# Altium project HT_L293D_Driver.PrjPcb
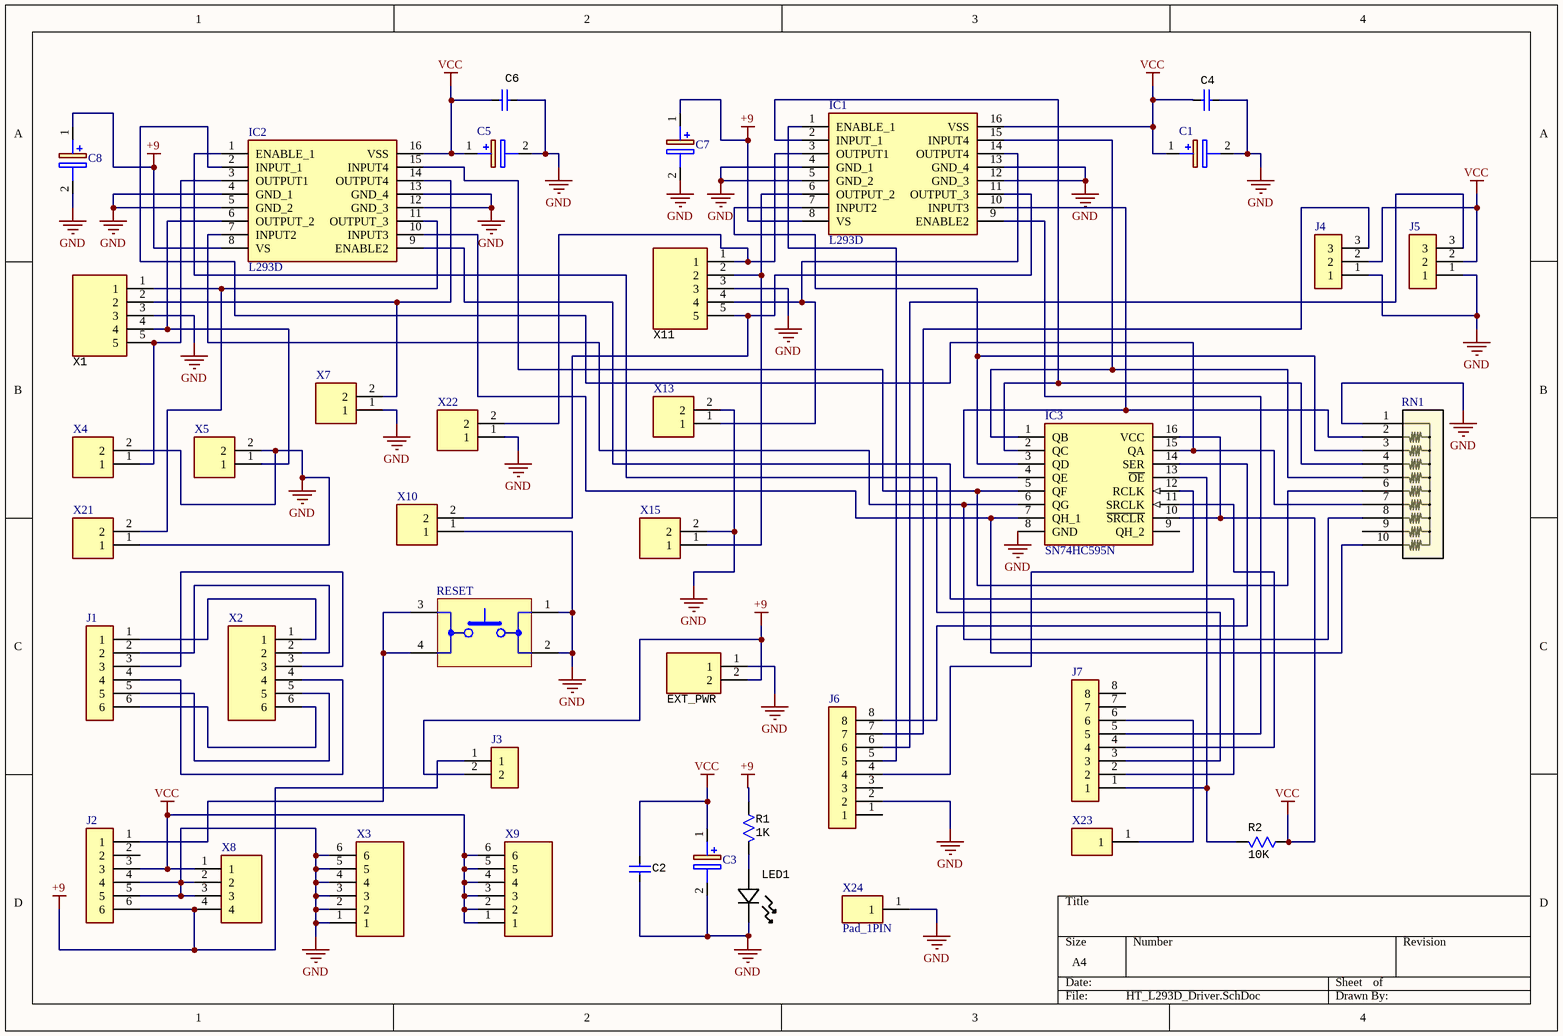
[diagram p0: HT_L293D_Driver.SchDoc]
1 sheet, 40 parts. Net scope: global (net labels, ports and power ports of the same name join across sheets).
Board file: HT_L293D_Driver.PcbDoc

## Sheet HT_L293D_Driver.SchDoc
size A4

### Parts
C1  Aluminum_Electrolytic_Capacitor  [Aluminum_Electrolytic_Capacitor]  (value not drawn)
C2  (no value)  [CERAMIC_CAPACITOR_0.1uF]
C3  Aluminum_Electrolytic_Capacitor  [Aluminum_Electrolytic_Capacitor]  (value not drawn)
C4  (no value)  [CERAMIC_CAPACITOR_0.1uF]
C5  Aluminum_Electrolytic_Capacitor  [Aluminum_Electrolytic_Capacitor]  (value not drawn)
C6  (no value)  [CERAMIC_CAPACITOR_0.1uF]
C7  Aluminum_Electrolytic_Capacitor  [Aluminum_Electrolytic_Capacitor]  (value not drawn)
C8  Aluminum_Electrolytic_Capacitor  [Aluminum_Electrolytic_Capacitor]  (value not drawn)
EXT_PWR  (no value)  [Terminal_Block_2PIN]
IC1  L293D  [L293D_WITH_DIP16]
IC2  L293D  [L293D_WITH_DIP16]
IC3  SN74HC595N  [L293D_WITH_DIP16]
J1  Headers_6PIN  [HEADERS_6PIN]  (value not drawn)
J2  Headers_6PIN  [HEADERS_6PIN]  (value not drawn)
J3  Headers_2PIN  [HEADERS_2PIN]  (value not drawn)
J4  Headers_3PIN  [HEADERS_3PIN]  (value not drawn)
J5  Headers_3PIN  [HEADERS_3PIN]  (value not drawn)
J6  Headers_8PIN  [HEADERS_8PIN]  (value not drawn)
J7  Headers_8PIN  [HEADERS_8PIN]  (value not drawn)
LED1  (no value)  [Green_LED_3mm]
R1  value 1K  [RESISTOR_TH_1K]
R2  value 10K  [RESISTOR_TH_10K]
RESET  1825910-6  [1825910-6]  (value not drawn)
RN1  Resistor_Network_10K  [RESISTOR_NETWORK_10K]  (value not drawn)
X1  (no value)  [TERMINAL_BLOCK_5PIN]
X2  Pad_6PIN  [PAD_6PIN]  (value not drawn)
X3  Pad_6PIN  [PAD_6PIN]  (value not drawn)
X4  Pad_2PIN  [PAD_2PIN]  (value not drawn)
X5  Pad_2PIN  [PAD_2PIN]  (value not drawn)
X7  Pad_2PIN  [PAD_2PIN]  (value not drawn)
X8  Pad_4PIN  [PAD_4PIN]  (value not drawn)
X9  Pad_6PIN  [PAD_6PIN]  (value not drawn)
X10  Pad_2PIN  [PAD_2PIN]  (value not drawn)
X11  (no value)  [TERMINAL_BLOCK_5PIN]
X13  Pad_2PIN  [PAD_2PIN]  (value not drawn)
X15  Pad_2PIN  [PAD_2PIN]  (value not drawn)
X21  Pad_2PIN  [PAD_2PIN]  (value not drawn)
X22  Pad_2PIN  [PAD_2PIN]  (value not drawn)
X23  Pad_1PIN  [PAD_1PIN]  (value not drawn)
X24  Pad_1PIN  [PAD_1PIN]

### Nets
+9: C7.1(+) C8.1(+) EXT_PWR.2 IC1.8(VS) IC2.8(VS) J2.6 J3.1 J3.2 R1.1 X8.4
GND: C1.2(-) C2.2 C3.2(-) C4.2 C5.2(-) C6.2 C7.2(-) C8.2(-) EXT_PWR.1 IC1.4(GND_1) IC1.5(GND_2) IC1.12(GND_3) IC1.13(GND_4) IC2.4(GND_1) IC2.5(GND_2) IC2.12(GND_3) IC2.13(GND_4) IC3.8(GND) J2.4 J2.5 J4.1 J5.1 J6.2 LED1.1 RESET.1 RESET.2 RN1.1 X1.3 X3.1 X3.2 X3.3 X3.4 X3.5 X3.6 X4.2 X5.2 X7.1 X8.2 X8.3 X10.1 X11.3 X13.2 X15.2 X21.1 X22.1 X24.1
VCC: C1.1(+) C2.1 C3.1(+) C4.1 C5.1(+) C6.1 IC1.16(VSS) IC2.16(VSS) IC3.10(~{SRCLR}) IC3.16(VCC) J2.3 J4.2 J5.2 R2.1 X8.1 X9.1 X9.2 X9.3 X9.4 X9.5 X9.6
NetIC1_1: IC1.1(ENABLE_1) J6.5
NetIC1_2: IC1.2(INPUT_1) IC3.2(QC) RN1.4
NetIC1_3: IC1.3(OUTPUT1) X11.1 X22.2
NetIC1_6: IC1.6(OUTPUT_2) X11.2 X15.1
NetIC1_7: IC1.7(INPUT2) IC3.3(QD) RN1.3
NetIC1_9: IC1.9(ENABLE2) J7.5
NetIC1_10: IC1.10(INPUT3) IC3.4(QE) RN1.2
NetIC1_11: IC1.11(OUTPUT_3) X10.2 X11.5
NetIC1_14: IC1.14(OUTPUT4) X11.4 X13.1
NetIC1_15: IC1.15(INPUT4) IC3.1(QB) RN1.5
NetIC2_1: IC2.1(ENABLE_1) J7.3
NetIC2_2: IC2.2(INPUT_1) IC3.15(QA) RN1.7
NetIC2_3: IC2.3(OUTPUT1) X1.5 X4.1
NetIC2_6: IC2.6(OUTPUT_2) X1.4 X5.1
NetIC2_7: IC2.7(INPUT2) IC3.6(QG) RN1.8
NetIC2_9: IC2.9(ENABLE2) J7.2
NetIC2_10: IC2.10(INPUT3) IC3.7(QH_1) RN1.10
NetIC2_11: IC2.11(OUTPUT_3) X1.1 X21.2
NetIC2_14: IC2.14(OUTPUT4) X1.2 X7.2
NetIC2_15: IC2.15(INPUT4) IC3.5(QF) RN1.6
NetIC3_11: IC3.11(SRCLK) J7.4
NetIC3_12: IC3.12(RCLK) J6.4
NetIC3_13: IC3.13(~{OE}) J7.1 R2.2
NetIC3_14: IC3.14(SER) J6.8
NetJ1_1: J1.1 X2.1
NetJ1_2: J1.2 X2.2
NetJ1_3: J1.3 X2.3
NetJ1_4: J1.4 X2.4
NetJ1_5: J1.5 X2.5
NetJ1_6: J1.6 X2.6
NetJ2_1: J2.1 RESET.3(MECH1) RESET.4(MECH2)
NetJ4_3: J4.3 J6.7
NetJ5_3: J5.3 J6.6
NetJ7_6: J7.6 X23.1
NetLED1_2: LED1.2 R1.2

Not connected (* = marked no-connect by the designer): IC3 9(QH_2); J2 2; J6 1 3; J7 7 8; RN1 9

### Library data of the parts
C1 = Aluminum_Electrolytic_Capacitor: Capacitor Polarised; Manufacturer_Name: United Chemi-Con; Manufacturer_Part_Number: EKY-350ETC221MH15D; Voltage: 100uF; Value: 16VDC; Datasheet Link: http://www.mouser.com/datasheet/2/420/United-Chemi-Con-1109128.pdf; Height: 21.5mm; Mouser Part Number: N/A; Mouser Price/Stock: https://www.mouser.com/Search/Refine.aspx?Keyword=N%2FA
C2 = Ceramic_Capacitor: Manufacturer: Epcos; PartNumber: B32774D4106K000; ValueManufacturerPartNumber: Film capacitor, 10μF, 450VDC, ±10%, 10.9mOhm, 31.5x15 mm, -40...+105°C; TypeCapacitor: Film capacitor; Tolerance: ±10%; Impedance: 10.9mOhm; Voltage: 450VDC; Value: 10μF; Package: 31.5x15 mm; HelpURL: https://www.digikey.com/products/en/capacitors/film-capacitors/62?k=&pkeyword=&sv=0&pv2097=1958&sf=0&FV=fffc01ef%2C1f140000%2Cffe0003e%2Cffec6366&quantity=1&ColumnSort=1000011&page=1&stock=1&pageSize=25; Temperature: -40...+105°C
C3 = Aluminum_Electrolytic_Capacitor: Capacitor Polarised; Manufacturer_Name: United Chemi-Con; Manufacturer_Part_Number: EKY-350ETC221MH15D; Value: 100uF; Voltage: 16VDC; Datasheet Link: http://www.mouser.com/datasheet/2/420/United-Chemi-Con-1109128.pdf; Height: 21.5mm; Mouser Part Number: N/A; Mouser Price/Stock: https://www.mouser.com/Search/Refine.aspx?Keyword=N%2FA
C4 = Ceramic_Capacitor: Capacitor Non Polarised; Manufacturer: Epcos; PartNumber: B32774D4106K000; ValueManufacturerPartNumber: Film capacitor, 0.1μF, 450VDC, ±10%, 10.9mOhm, 31.5x15 mm, -40...+105°C; TypeCapacitor: Film capacitor; Tolerance: ±10%; Impedance: 10.9mOhm; Voltage: 450VDC; Value: 0.1μF; Package: 31.5x15 mm; HelpURL: https://www.digikey.com/products/en/capacitors/film-capacitors/62?k=&pkeyword=&sv=0&pv2097=1958&sf=0&FV=fffc01ef%2C1f140000%2Cffe0003e%2Cffec6366&quantity=1&ColumnSort=1000011&page=1&stock=1&pageSize=25; Temperature: -40...+105°C
C5 C7 C8 = Aluminum_Electrolytic_Capacitor: Capacitor Polarised; Manufacturer_Name: United Chemi-Con; Manufacturer_Part_Number: EKY-350ETC221MH15D; Voltage: 16VDC; Value: 100uF; Datasheet Link: http://www.mouser.com/datasheet/2/420/United-Chemi-Con-1109128.pdf; Height: 21.5mm; Mouser Part Number: N/A; Mouser Price/Stock: https://www.mouser.com/Search/Refine.aspx?Keyword=N%2FA
C6 = Ceramic_Capacitor: Manufacturer: Epcos; PartNumber: B32774D4106K000; ValueManufacturerPartNumber: Film capacitor, 0.1μF, 450VDC, ±10%, 10.9mOhm, 31.5x15 mm, -40...+105°C; TypeCapacitor: Film capacitor; Tolerance: ±10%; Impedance: 10.9mOhm; Voltage: 450VDC; Value: 0.1μF; Package: 31.5x15 mm; HelpURL: https://www.digikey.com/products/en/capacitors/film-capacitors/62?k=&pkeyword=&sv=0&pv2097=1958&sf=0&FV=fffc01ef%2C1f140000%2Cffe0003e%2Cffec6366&quantity=1&ColumnSort=1000011&page=1&stock=1&pageSize=25; Temperature: -40...+105°C
EXT_PWR = Terminal_Block_2PIN: Manufacturer: Degson; ValueManufacturerPartNumber: Terminal connector, 2pin, 3.5mm, 300VAC, 10A; PartNumber: DG350-3.5-02P-14; TypeConnector: Terminal connector; VoltageMax: 300VAC; Pitch: 3.5mm; CurrentMax: 10A; Multichannel: 2pin; CommentText: "Разъем"; HelpURL: https://www.chipdip.ru/product/dg350-3.5-02p-12
IC1 IC2 = L293D: Integrated Circuit; Manufacturer_Name: STMicroelectronics; Datasheet Link: http://www.st.com/web/en/resource/technical/document/datasheet/CD00000059.pdf; Height: 5.1mm; Manufacturer_Part_Number: L293D; Mouser Part Number: 511-L293D; Mouser Price/Stock: https://www.mouser.co.uk/ProductDetail/STMicroelectronics/L293D?qs=gr8Zi5OG3MgMJ1ICDzLQbg%3D%3D; Arrow Part Number: L293D; Arrow Price/Stock: https://www.arrow.com/en/products/l293d/stmicroelectronics?region=nac
IC3 = SN74HC595N: Integrated Circuit; Manufacturer_Name: Texas Instruments; Datasheet Link: http://www.ti.com/lit/ds/symlink/sn74hc595.pdf; Height: 5.08mm; Manufacturer_Part_Number: SN74HC595N; Mouser Part Number: 595-SN74HC595N; Mouser Price/Stock: https://www.mouser.co.uk/ProductDetail/Texas-Instruments/SN74HC595N?qs=IEl3ej0IqwBTHkYa8XPoMQ%3D%3D; Arrow Part Number: SN74HC595N; Arrow Price/Stock: https://www.arrow.com/en/products/sn74hc595n/texas-instruments?region=nac
J1 J2 = Headers_6PIN: MF: {'manufacturer': u'TE Connectivity'}; MP: 87227-3; Price: None; Availability: Unavailable; Value: *; Package: None
J3 = Headers_2PIN: MF: {'manufacturer': u'TE Connectivity'}; MP: 87227-3; Price: None; Availability: Unavailable; Value: *; Package: None
J4 J5 = Headers_3PIN: MF: {'manufacturer': u'TE Connectivity'}; MP: 87227-3; Price: None; Availability: Unavailable; Value: *; Package: None
J6 J7 = Headers_8PIN: MF: {'manufacturer': u'TE Connectivity'}; MP: 87227-3; Price: None; Availability: Unavailable; Value: *; Package: None
LED1 = Green_LED_3mm: ValueManufacturerPartNumber: LED, Green, *, *, *, -55...+150°C; TypeDiode: LED; ColorParameter: Green; Manufacturer: *; Package: *; HelpURL: *; Temperature: -55...+150°C; Current: *; VoltageDrop: *; PartNumber: *
R1 = Resistor_1K: Manufacturer: Yageo; PartNumber: RC0201JR-07100RL; TypeResistor: Resistor film; Power: 0.05W; Package: 0201; HelpURL: https://www.digikey.com/product-detail/en/yageo/RC0201JR-07100RL/311-100NCT-ND/1949006; ValueManufacturerPartNumber: =TypeResistor+', '+Value+', '+Tolerance+', '+Package+', '+Power+', '+Temperature; Temperature: -55...+125°C
R2 = Resistor_10K: Manufacturer: Yageo; PartNumber: RC0201JR-07100RL; TypeResistor: Resistor film; Power: 0.05W; Package: 0201; HelpURL: https://www.digikey.com/product-detail/en/yageo/RC0201JR-07100RL/311-100NCT-ND/1949006; ValueManufacturerPartNumber: =TypeResistor+', '+Value+', '+Tolerance+', '+Package+', '+Power+', '+Temperature; Temperature: -55...+125°C
RESET = Button_Reset: SWITCH TACTILE SPST-NO 0.05A 24V; Manufacturer: TE Connectivity; Switch Function: Off-Mom; Contact Rating @ Voltage: 0.05A @ 24VDC; Actuator Type: Standard; Actuator Height off PCB, from Pins: 5.00mm; Actuator Orientation: Top Actuated; Outline: 6.00mm x 6.00mm; Illumination: Non-Illuminated; Operating Force: 160gf; Actuator Material: Polybutylene Terephthalate (PBT); Switch Travel: 0.25mm; Mechanical Life: 100,000 Cycles; .Creator: MM; .Checked PCB: RF; Supplier 1: Digi-Key; Manufacturer Part Number: 1825910-6; RoHS: RoHS Compliant; Category: Switches; Stock 1: 181823; Pricing 1: 1=0.1, 10=0.095, 25=0.0912, 50=0.088, 100=0.0831, 250=0.07824, 500=0.07498, 1000=0.05705 (USD); Packaging: Bulk; Circuit: SPST-NO; Mounting Type: Through Hole; Termination Style: PC Pin; Illumination Voltage (Nominal): -; Illumination Type, Color: -; Ingress Protection: -; Features: -; Operating Temperature: -35°C ~ 85°C; ComponentLink1URL: http://www.te.com/commerce/DocumentDelivery/DDEController?Action=srchrtrv&DocNm=1825910&DocType=Customer+Drawing&DocLang=English; ComponentLink1Description: http://www.te.com/commerce/DocumentDelivery/DDEController?Action=srchrtrv&DocNm=1825910&DocType=Customer+Drawing&DocLang=English; Supplier Part Number 1: 450-1650-ND; .Checked SCH: RF
X1 X11 = Terminal_Block_5PIN: Manufacturer: Degson; ValueManufacturerPartNumber: Terminal connector, 3pin, 3.5mm, 300VAC, 10A; PartNumber: DG350-3.5-03P-14; TypeConnector: Terminal connector; VoltageMax: 300VAC; Pitch: 3.5mm; CurrentMax: 10A; Multichannel: 3pin; CommentText: "Разъем"; HelpURL: https://www.chipdip.ru/product/dg350-3.5-03p-12